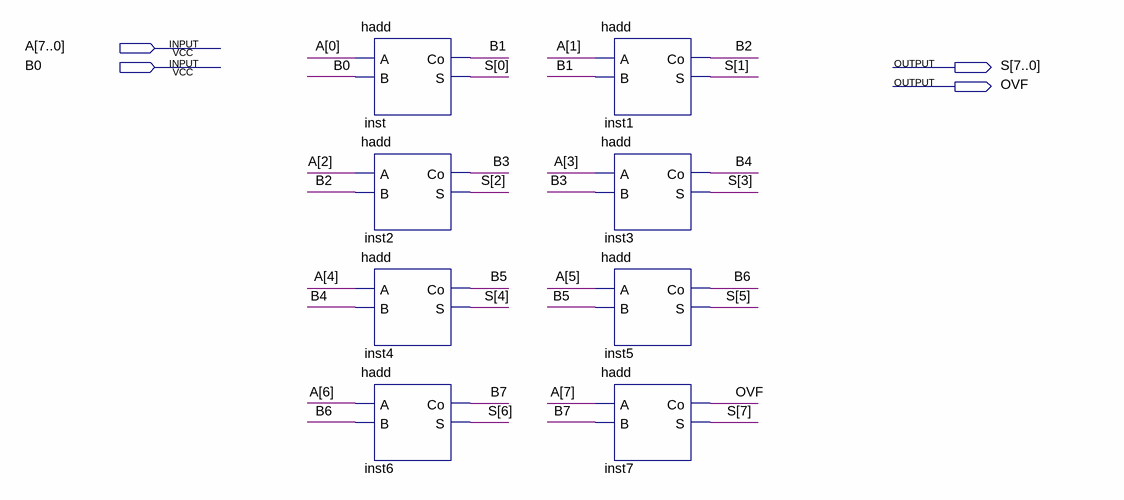
[diagram p0: schematic sheet]
// Quartus schematic hadd8.bdf as structural Verilog: 8 symbols, 4 pins
module hadd8 (
  input  [7:0] A,
  input  B0,
  output [7:0] S,
  output OVF
);

  wire B1, B2, B3, B4, B5, B6, B7;

  hadd inst (.A(A[0]), .B(B0), .Co(B1), .S(S[0]));
  hadd inst2 (.A(A[2]), .B(B2), .Co(B3), .S(S[2]));
  hadd inst4 (.A(A[4]), .B(B4), .Co(B5), .S(S[4]));
  hadd inst6 (.A(A[6]), .B(B6), .Co(B7), .S(S[6]));
  hadd inst1 (.A(A[1]), .B(B1), .Co(B2), .S(S[1]));
  hadd inst3 (.A(A[3]), .B(B3), .Co(B4), .S(S[3]));
  hadd inst5 (.A(A[5]), .B(B5), .Co(B6), .S(S[5]));
  hadd inst7 (.A(A[7]), .B(B7), .Co(OVF), .S(S[7]));
endmodule
